# EAGLE design PET_Diag_Clip (EAGLE 9.6.2)
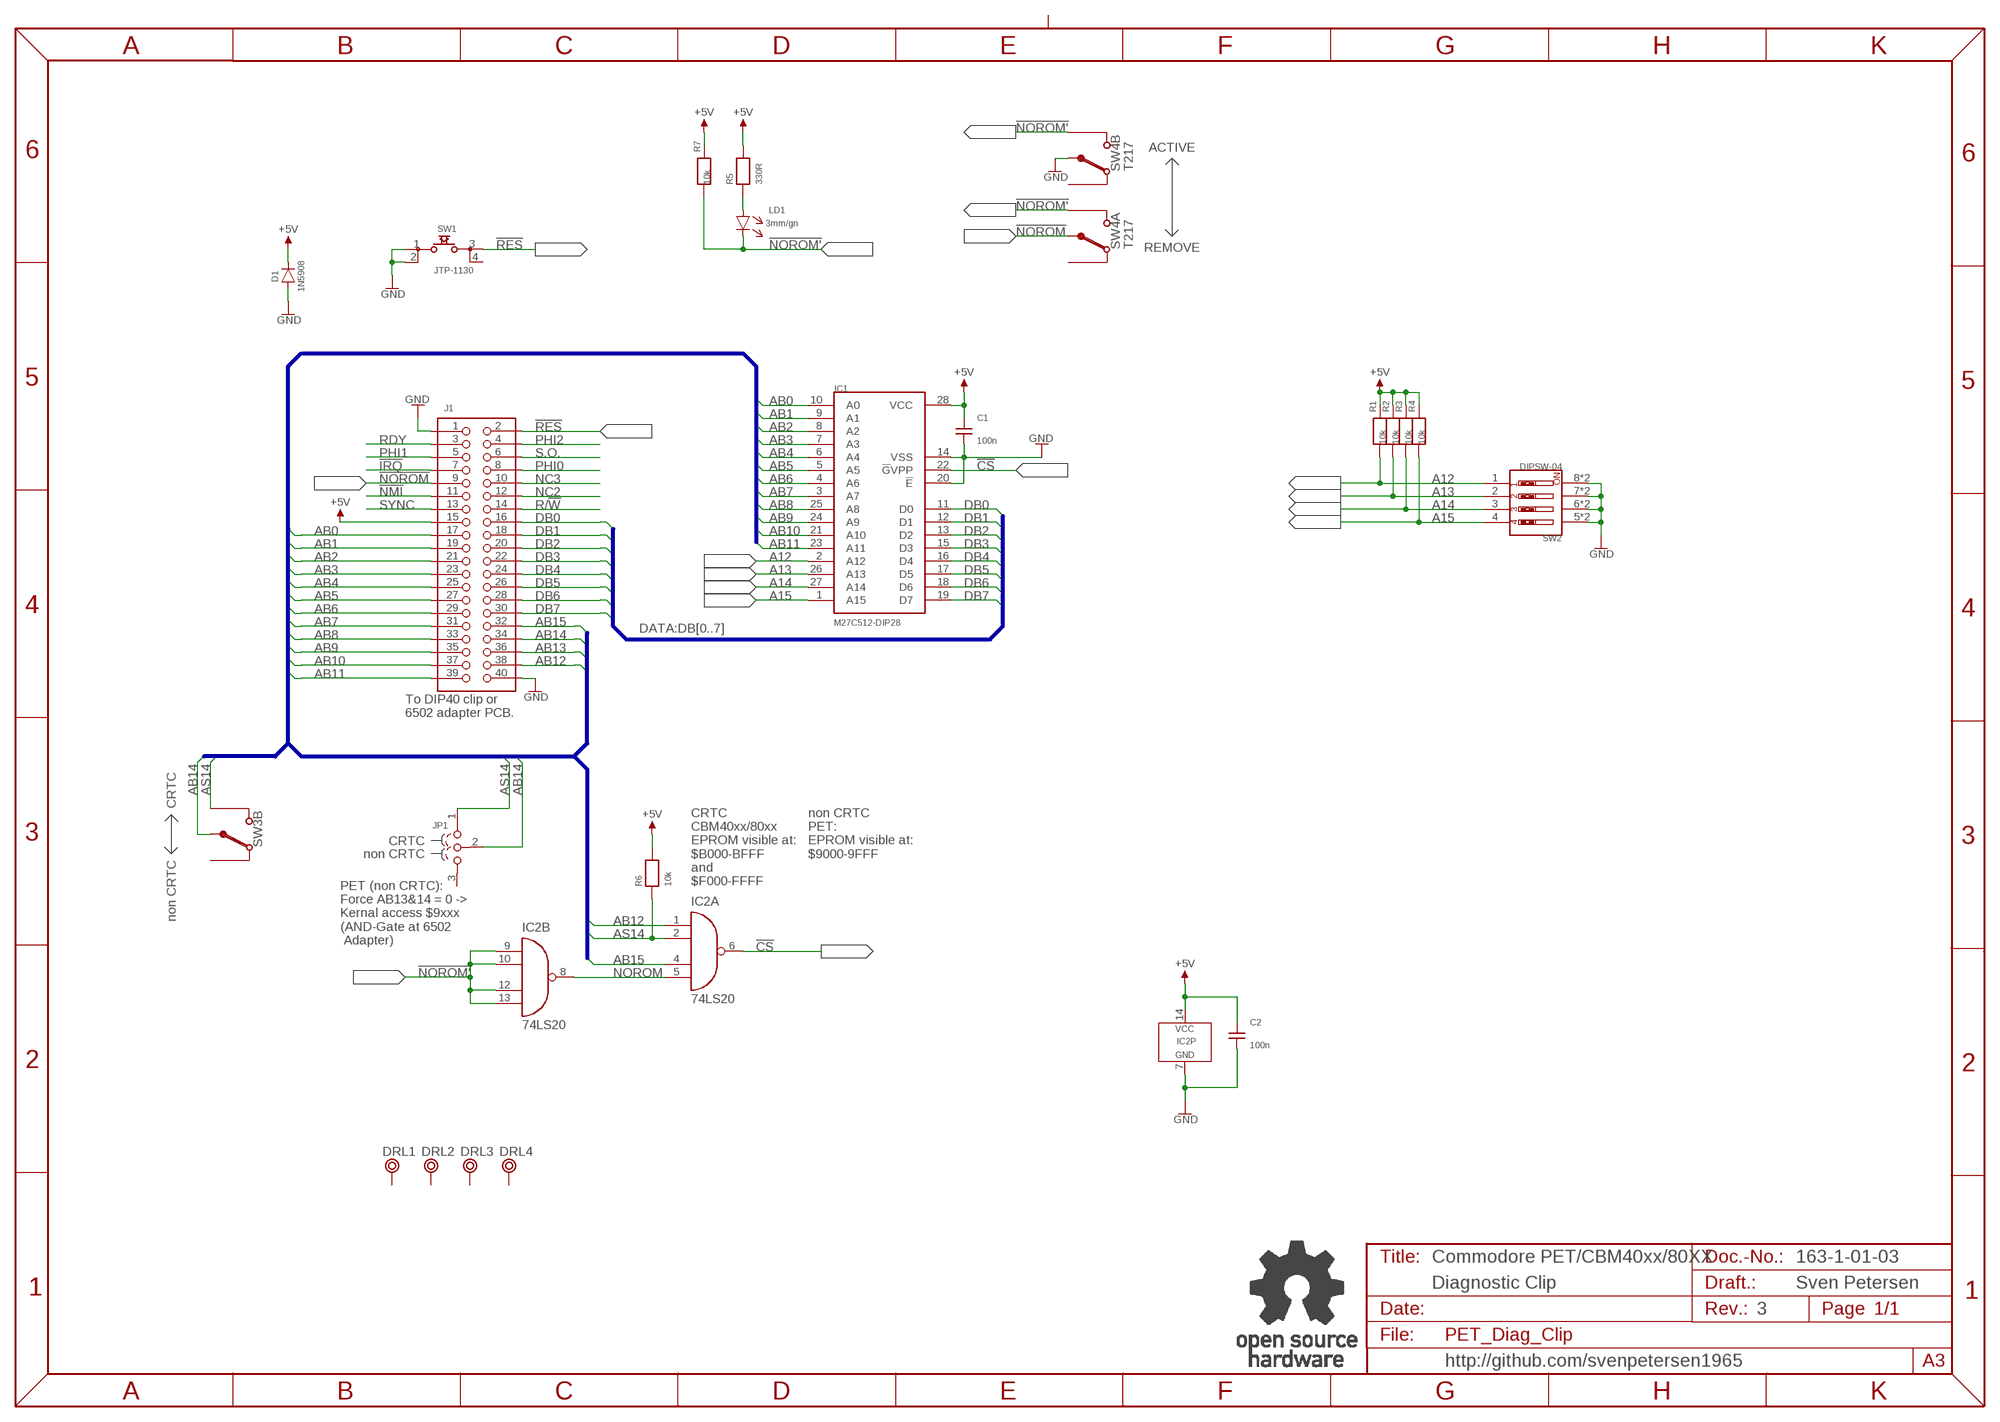
[diagram p0: schematic, sheet 1]

## Parts
C1  100n  CAP01  [C-2,5]
C2  100n  CAP01  [C-2,5]
D1  1N5908  1N5402  [DO-201]
DRL1  BOHR3,5  [BOHR3,5]
DRL2  BOHR3,5  [BOHR3,5]
DRL3  BOHR3,5  [BOHR3,5]
DRL4  BOHR3,5  [BOHR3,5]
IC1  M27C512-DIP28  [DIL28-6]
IC2  74LS20  7420N  [DIL-14]
J1  PINHD-2X20WV  [2X20WV]
JP1  COMBI-3P  [COMBI-3P]
LD1  3mm/gn  3MM  [3MM]
R1  10k  RES04  [R-10]
R2  10k  RES04  [R-10]
R3  10k  RES04  [R-10]
R4  10k  RES04  [R-10]
R5  330R  RES04  [R-10]
R6  10k  RES04  [R-10]
R7  10k  RES04  [R-10]
SW1  JTP-1130  [JTP-1130]
SW2  DIPSW-04  [DIPSW-04V-COMBI]
SW3  MSS22D18  DPDT_9MM  [DPDT_9MM]
SW4  T217  [T217_SIDE]
U$13  OPEN_SOURCE_HW  [OPENHW]

## Nets
!CS: IC1.22(!G!VPP) IC2.6(A:O)
!IRQ: J1.7
!NMI: J1.11
!NOROM: J1.9 SW4.COM1(A:COM)
!NOROM': IC2.9(B:I0) IC2.10(B:I1) IC2.12(B:I2) IC2.13(B:I3) LD1.C(K) R7.2 SW4.UP1(A:UP) SW4.UP2(B:UP)
!RES: J1.2 SW1.3
+5V: C1.2 C2.2 D1.K IC1.28(VCC) IC2.14(P:VCC) J1.15 R1.1 R2.1 R3.1 R4.1 R5.2 R6.2 R7.1
A12: IC1.2(A12) R1.2 SW2.1
A13: IC1.26(A13) R2.2 SW2.2
A14: IC1.27(A14) R3.2 SW2.3
A15: IC1.1(A15) R4.2 SW2.4
AB0: IC1.10(A0) J1.17
AB1: IC1.9(A1) J1.19
AB2: IC1.8(A2) J1.21
AB3: IC1.7(A3) J1.23
AB4: IC1.6(A4) J1.25
AB5: IC1.5(A5) J1.27
AB6: IC1.4(A6) J1.29
AB7: IC1.3(A7) J1.31
AB8: IC1.25(A8) J1.33
AB9: IC1.24(A9) J1.35
AB10: IC1.21(A10) J1.37
AB11: IC1.23(A11) J1.39
AB12: IC2.1(A:I0) J1.38
AB13: J1.36
AB14: J1.34 JP1.2 SW3.5(B:COM)
AB15: IC2.4(A:I2) J1.32
AS14: IC2.2(A:I1) JP1.1 R6.1 SW3.6(B:UP)
DB0: IC1.11(D0) J1.16
DB1: IC1.12(D1) J1.18
DB2: IC1.13(D2) J1.20
DB3: IC1.15(D3) J1.22
DB4: IC1.16(D4) J1.24
DB5: IC1.17(D5) J1.26
DB6: IC1.18(D6) J1.28
DB7: IC1.19(D7) J1.30
GND: C1.1 C2.1 D1.A IC1.14(VSS) IC1.20(!E) IC2.7(P:GND) J1.1 J1.40 SW1.1 SW1.2 SW2.5 SW2.5A SW2.6 SW2.6A SW2.7 SW2.7A SW2.8 SW2.8A SW4.COM2(B:COM)
N$1: LD1.A R5.1
NC2: J1.12
NC3: J1.10
NOROM: IC2.5(A:I3) IC2.8(B:O)
PHI0: J1.8
PHI1: J1.5
PHI2: J1.4
R/!W: J1.14
RDY: J1.3
S.O.: J1.6
SYNC: J1.13
Unconnected: DRL1.P$1 DRL2.P$1 DRL3.P$1 DRL4.P$1 JP1.3 SW1.4 SW3.1(A:UP) SW3.2(A:COM) SW3.3(A:DWN) SW3.4(B:DWN) SW4.DWN1(A:DWN) SW4.DWN2(B:DWN)

## Buses
DATA:DB[0..7]
ADR:AB[0..15],AS14

## Notes on the sheet
- ACTIVE
- REMOVE
- To DIP40 clip or
  6502 adapter PCB.
- CRTC
- CRTC
  CBM40xx/80xx
  EPROM visible at:
  $B000-BFFF
  and
  $F000-FFFF
- non CRTC
  PET:
  EPROM visible at:
  $9000-9FFF
- CRTC
- non CRTC
- non CRTC
- PET (non CRTC):
  Force AB13&14 = 0 ->
  Kernal access $9xxx
  (AND-Gate at 6502
   Adapter)
- Commodore PET/CBM40xx/80XX | 163-1-01-03
- Diagnostic Clip | Sven Petersen
- 3
- http://github.com/svenpetersen1965

## Library data of the parts
C1 C2 = DISCRETE:CAP01
D1 = Dioden:1N5402
DRL1-DRL4 = Mech_Bohr:BOHR3,5
IC1 = ST:M27C512
IC2 = 74XX:7420
J1 = PINHEAD:PINHD-2X20
JP1 = Cutpad:COMBI-3P
LD1 = LED:3MM
R1-R7 = DISCRETE:RES04
SW1 = Namae_Electronics:JTP-1130
SW2 = DIPSWITCH:DIPSW-04
SW3 = switches:DPDT_9MM
SW4 = wentronic:T217
U$13 = Logo:OPEN_SOURCE_HW

## Board
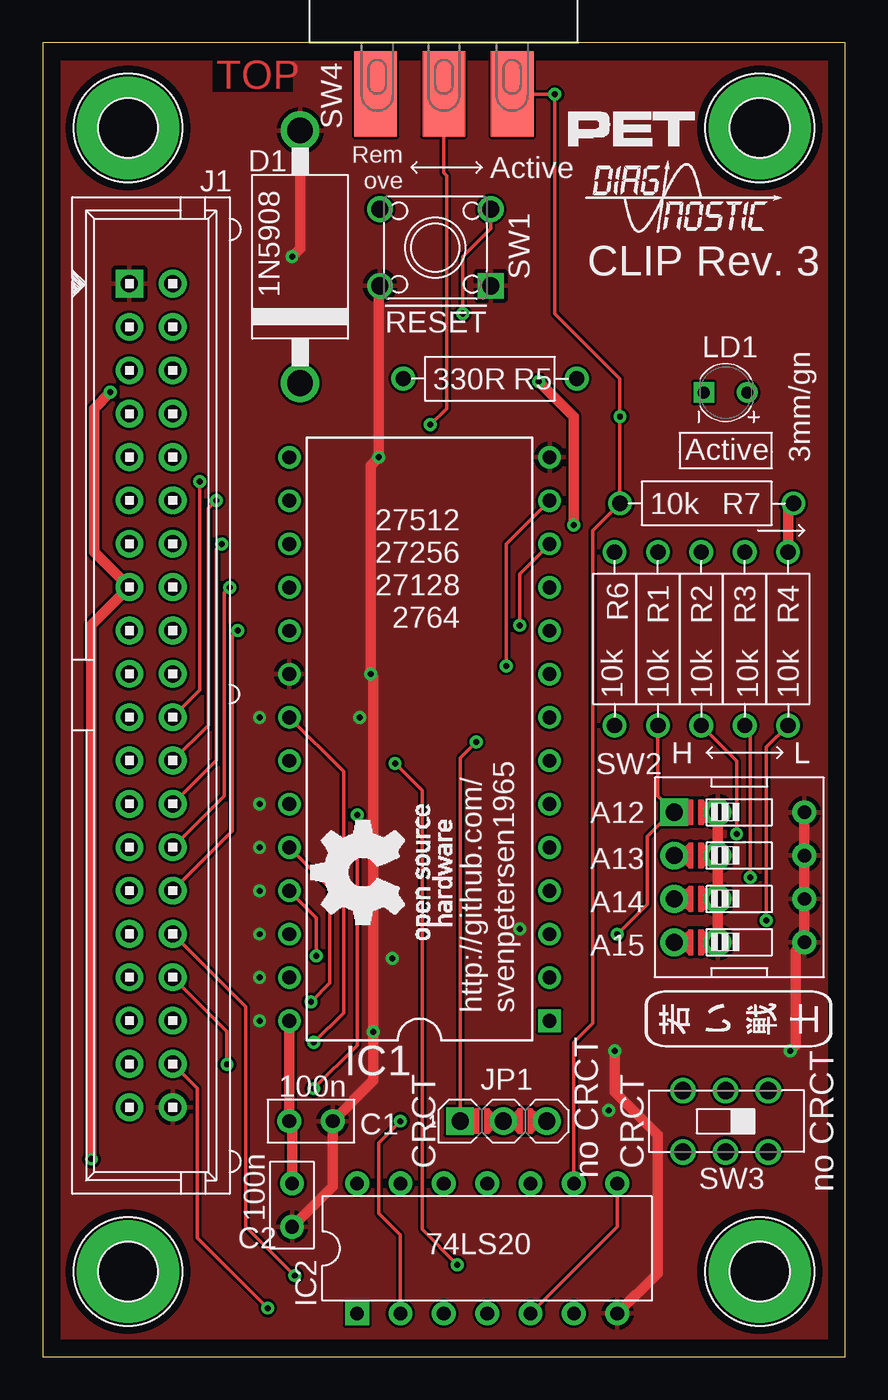
[diagram p1: board, top side]
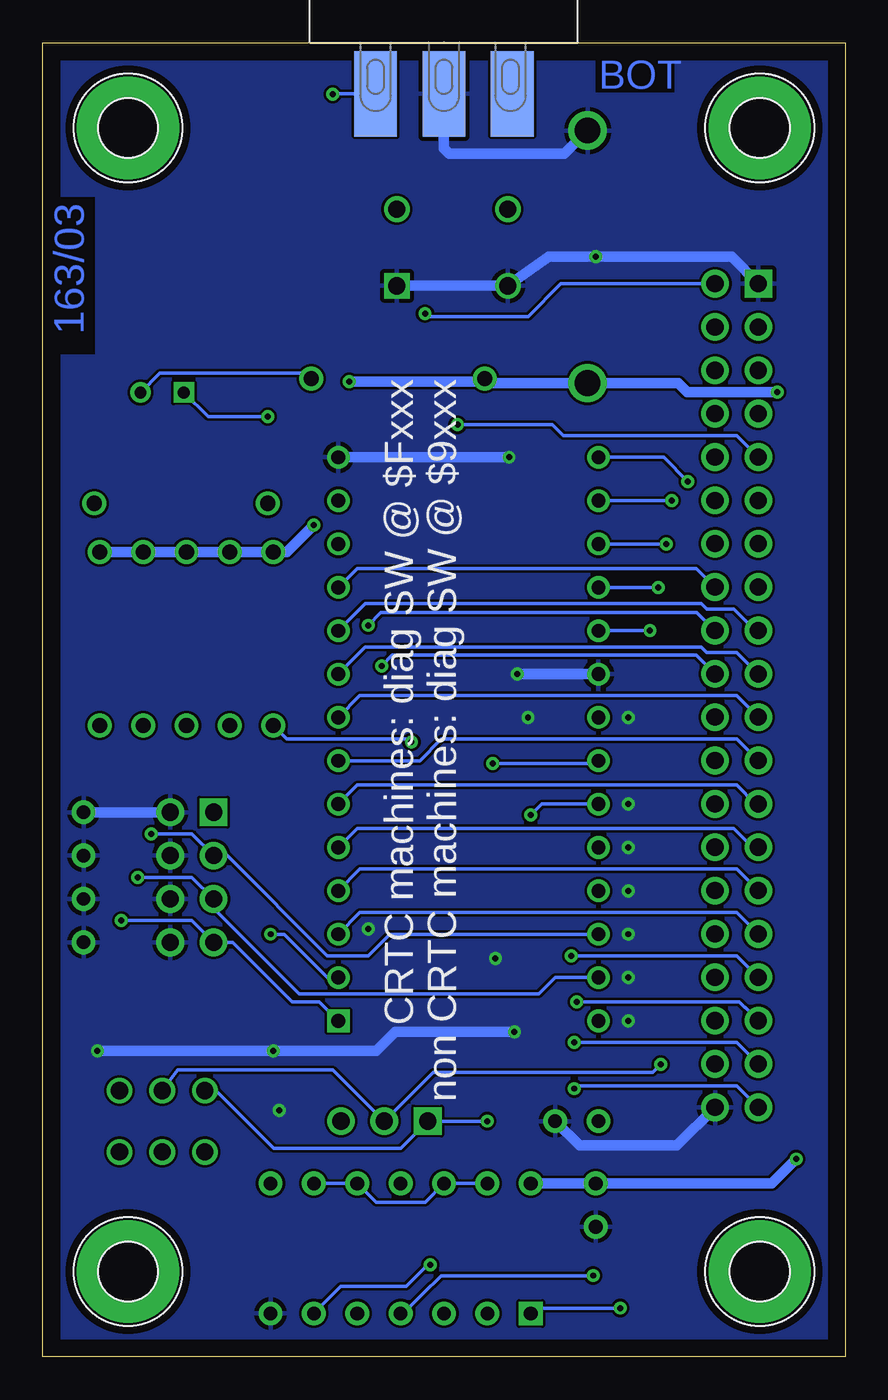
[diagram p2: board, bottom side, seen from below]

Size 47 x 77 mm. Coordinates in mm from the lower left corner, seen from the top.
Outline: 0,0 47,0 47,77 0,77 0,0
Copper layers (1*16): Top 0.035mm / dielectric 1.5mm / Bottom 0.035mm
Design rules "default *": minimum track width 6mil, minimum drill 0.35mm, track to track 6mil, track to pad 6mil, pad to pad 6mil, via to via 6mil, smd to smd 6mil, copper to edge 40mil, drill to drill 6mil, minimum pad ring 10mil, minimum via ring 8mil, stop-mask expansion 4mil, vias tented up to drill 25mil, thermal gap 10mil
bRestrict: 3 lines

### Footprints (pad centres in the part's own frame; a part is rotated, then mirrored left to right if it is on the bottom)
C-2,5 = drill 0.8 pad 1.397: 1 -1.27,0; 2 1.27,0
DO-201 = drill 1.5: A -7.4,0; K 7.4,0
BOHR3,5 = drill 3.5 pad 6: P$1 0,0
DIL28-6 = drill 0.813 square: 1 -16.51,-7.62 | drill 0.813: 2 -13.97,-7.62; 3 -11.43,-7.62; 4 -8.89,-7.62; 5 -6.35,-7.62; 6 -3.81,-7.62; 7 -1.27,-7.62; 8 1.27,-7.62; 9 3.81,-7.62; 10 6.35,-7.62; 11 8.89,-7.62; 12 11.43,-7.62; 13 13.97,-7.62; 14 16.51,-7.62; 15 16.51,7.62; 16 13.97,7.62; 17 11.43,7.62; 18 8.89,7.62; 19 6.35,7.62; 20 3.81,7.62; 21 1.27,7.62; 22 -1.27,7.62; 23 -3.81,7.62; 24 -6.35,7.62; 25 -8.89,7.62; 26 -11.43,7.62; 27 -13.97,7.62; 28 -16.51,7.62
DIL-14 = drill 0.8 pad 1.397 square: 1 -7.62,-3.81 | drill 0.8 pad 1.397: 2 -5.08,-3.81; 3 -2.54,-3.81; 4 0,-3.81; 5 2.54,-3.81; 6 5.08,-3.81; 7 7.62,-3.81; 8 7.62,3.81; 9 5.08,3.81; 10 2.54,3.81; 11 0,3.81; 12 -2.54,3.81; 13 -5.08,3.81; 14 -7.62,3.81
2X20WV = drill 1 pad 1.626 square: 1 -24.13,-1.27 | drill 1 pad 1.626: 2 -24.13,1.27; 3 -21.59,-1.27; 4 -21.59,1.27; 5 -19.05,-1.27; 6 -19.05,1.27; 7 -16.51,-1.27; 8 -16.51,1.27; 9 -13.97,-1.27; 10 -13.97,1.27; 11 -11.43,-1.27; 12 -11.43,1.27; 13 -8.89,-1.27; 14 -8.89,1.27; 15 -6.35,-1.27; 16 -6.35,1.27; 17 -3.81,-1.27; 18 -3.81,1.27; 19 -1.27,-1.27; 20 -1.27,1.27; 21 1.27,-1.27; 22 1.27,1.27; 23 3.81,-1.27; 24 3.81,1.27; 25 6.35,-1.27; 26 6.35,1.27; 27 8.89,-1.27; 28 8.89,1.27; 29 11.43,-1.27; 30 11.43,1.27; 31 13.97,-1.27; 32 13.97,1.27; 33 16.51,-1.27; 34 16.51,1.27; 35 19.05,-1.27; 36 19.05,1.27; 37 21.59,-1.27; 38 21.59,1.27; 39 24.13,-1.27; 40 24.13,1.27
COMBI-3P = drill 1 pad 1.626 square: 1 -2.54,0 | drill 1 pad 1.626: 2 0,0; 3 2.54,0
3MM = drill 0.7: A -1.27,0 | drill 0.7 square: C 1.27,0
R-10 = drill 0.889 pad 1.397: 1 -5.08,0; 2 5.08,0
JTP-1130 = drill 1 square: 1 3.25,-2.25 | drill 1: 2 -3.25,-2.25; 3 3.25,2.25; 4 -3.25,2.25
DIPSW-04V-COMBI = drill 1 pad 1.626 square: 1 -3.81,-3.81 | drill 1 pad 1.626: 2 -1.27,-3.81; 3 1.27,-3.81; 4 3.81,-3.81; 5A 3.81,-1.27; 6A 1.27,-1.27; 7A -1.27,-1.27; 8A -3.81,-1.27 | drill 0.787 pad 1.397: 5 3.81,3.81; 6 1.27,3.81; 7 -1.27,3.81; 8 -3.81,3.81
DPDT_9MM = drill 1: 1 -1.8,2.5; 2 -1.8,0; 3 -1.8,-2.5; 4 1.8,-2.5; 5 1.8,0; 6 1.8,2.5
T217_SIDE = smd 5 x 2.5: COM1 3,0; DWN1 3,-4; UP1 3,4 | smd 5 x 2.5 bottom: COM2 3,0; DWN2 3,-4; UP2 3,4

### Placement (x,y rotation side)
C1  15.72,13.81 180 top
C2  14.61,8.89 90 top
D1  15.08,64.45 270 top
DRL1  5,5 0 top
DRL2  42,5 0 top
DRL3  42,72 0 top
DRL4  5,72 0 top
IC1  22.07,36.2 90 top
IC2  26.04,6.35 0 top
J1  6.35,38.75 270 top
JP1  26.99,13.81 0 top
LD1  40,56.5 180 top
R1  36.04,42.07 270 top
R2  38.58,42.07 270 top
R3  41.12,42.07 270 top
R4  43.66,42.07 270 top
R5  26.19,57.31 180 top
R6  33.5,42.07 90 top
R7  38.89,50.01 180 top
SW1  23,65 0 top
SW2  40.8,28.1 270 top
SW3  40,13.8 90 top
SW4  23.5,77 270 top
U$13  23.97,24.45 90 top
U$27  [PET_SMALL]  30.8,70.96 0 top
U$30  [DIAG_SMALL]  31.75,65.88 0 top
U$34  [2LAYER]  10.16,74.3 0 top
U$35  [PCB-TITLE/]  0.48,93.34 0 top  (outside the outline)
U$42  [SVEN_TAG]  40.64,19.84 90 top

### Tracks (layer width: path | path; a pad name or v marks a point on that pad's centre or on a via)
!CS  (via drill 0.35)
  Top 0.203: v24.29,5.4 22.23,7.46 22.23,33.18 v20.64,34.77
  Bottom 0.203: v24.29,5.4 24.45,5.4 25.72,4.13 29.53,4.13 IC2.6 | v20.64,34.77 14.61,34.77 IC1.22
!NOROM  (via drill 0.35)
  Top 0.203: v22.7,54.61 23.65,55.56 23.65,69.22 23.5,69.37 SW4.COM1
  Bottom 0.203: J1.9 6.33,53.98 16.51,53.98 17.14,54.61 v22.7,54.61
!NOROM'  (via drill 0.35)
  Top 0.203: IC2.9 31.11,18.41 32.23,19.53 32.23,48.42 R7.2 v33.81,55.09 33.81,57.31 30,61.12 v30,73.98 27.52,73.98 SW4.UP1
  Bottom 0.203: v33.81,55.09 37.32,55.09 LD1.C | IC2.13 IC2.12 24.61,9.05 27.46,9.05 IC2.10 IC2.9 | SW4.UP1 29.98,74 v30,73.98
!RES  (via drill 0.35)
  Top 0.203: v24.61,61.12 24.61,64.45 26.25,66.1 SW1.3
  Bottom 0.203: J1.2 16.65,62.88 18.57,60.96 24.45,60.96 v24.61,61.12
+5V  (via drill 0.35)
  Top 0.61: IC1.28 C1.2 14.61,13.65 C2.2 | v2.86,11.59 2.86,42.88 J1.15 3.02,47.16 3.02,55.56 v3.97,56.52 | v31.11,48.74 31.11,55.09 v29.05,57.15 | R4.1 43.66,49.69 R7.1
  Bottom 0.61: IC2.14 C2.2 4.29,10.16 v2.86,11.59 | v3.97,56.52 4.54,56.52 | 4.54,56.52 4.55,56.53 | R4.1 R3.1 R2.1 R1.1 R6.2 32.7,47.15 v31.11,48.74 | 4.54,56.52 4.55,56.53 | 4.55,56.53 9.26,56.53 9.78,57.05 D1.K 20.86,57.05 R5.2 21.27,57.15 v29.05,57.15
A12  (via drill 0.35)
  Top 0.203: v33.66,24.77 35.4,26.51 35.4,30.48 36.83,31.91 SW2.1 36.04,32.86 R1.2
  Bottom 0.203: IC1.2 30.32,22.23 32.86,24.77 v33.66,24.77
A13  (via drill 0.35)
  Top 0.203: v40.64,30.64 40.64,34.92 R2.2
  Bottom 0.203: IC1.26 26.67,24.77 27.94,23.5 30.32,23.5 36.2,29.37 SW2.2 38.26,30.64 v40.64,30.64
A14  (via drill 0.35)
  Top 0.203: v41.43,28.1 41.43,36.67 R3.2
  Bottom 0.203: IC1.27 16.99,22.23 17.94,21.27 31.98,21.27 36.99,26.28 SW2.3 38.26,28.1 v41.43,28.1
A15  (via drill 0.35)
  Top 0.203: v42.39,25.56 42.39,35.72 R4.2
  Bottom 0.203: IC1.1 30.8,20.8 32.38,20.8 35.88,24.29 SW2.4 38.26,25.56 v42.39,25.56
AB0
  Bottom 0.203: J1.17 5.25,42.56 6.51,43.81 8.1,43.81 8.26,43.97 8.41,44.13 28.1,44.13 28.42,43.81 IC1.10
AB1
  Bottom 0.203: J1.19 6.33,41.27 8.1,41.27 8.41,41.59 15.56,41.59 28.1,41.59 28.42,41.27 IC1.9
AB2
  Bottom 0.203: J1.21 6.33,38.73 28.42,38.73 IC1.8
AB3
  Bottom 0.203: J1.23 6.33,36.2 23.65,36.2 24.92,34.92 IC1.7
AB4
  Bottom 0.203: J1.25 5.25,32.4 6.35,33.5 28.57,33.5 IC1.6
AB5
  Bottom 0.203: J1.27 5.41,29.86 6.51,30.96 28.57,30.96 IC1.5
AB6
  Bottom 0.203: J1.29 6.33,28.57 28.42,28.57 IC1.4
AB7
  Bottom 0.203: J1.31 6.33,26.04 28.42,26.04 IC1.3
AB8  (via drill 0.35)
  Top 0.203: v16.03,23.5 16.03,25.72 IC1.25
  Bottom 0.203: J1.33 6.33,23.5 v16.03,23.5
AB9  (via drill 0.35)
  Top 0.203: v15.72,20.8 16.83,21.91 16.83,27.46 IC1.24
  Bottom 0.203: J1.35 5.86,20.48 5.87,20.48 6.19,20.8 15.08,20.8 v15.72,20.8
AB10  (via drill 0.35)
  Top 0.203: v15.88,18.41 17.62,20.16 17.62,34.29 IC1.21
  Bottom 0.203: J1.37 6.33,18.41 v15.88,18.41
AB11  (via drill 0.35)
  Top 0.203: v15.88,15.72 18.41,18.26 v18.41,31.75
  Bottom 0.203: J1.39 6.33,15.88 15.88,15.88 v15.88,15.72 | v18.41,31.75 17.78,32.38 IC1.23
AB12  (via drill 0.35)
  Top 0.203: J1.38 9.05,15.73 9.05,6.99 v13.18,2.86
  Bottom 0.203: v13.18,2.86 18.1,2.86 IC2.1
AB14  (via drill 0.35)
  Top 0.203: J1.34 10.79,19.07 v10.79,17.14
  Bottom 0.203: v10.79,17.14 11.27,16.67 24.13,16.67 JP1.2 30,16.83 39.08,16.83 SW3.5
AB15  (via drill 0.35)
  Top 0.203: J1.32 11.91,20.49 11.91,7.62 v14.76,4.76
  Bottom 0.203: v14.76,4.76 23.65,4.76 24.77,3.65 25.88,2.54 IC2.4
AS14  (via drill 0.35)
  Top 0.203: IC2.2 20.95,7.14 19.68,8.41 19.68,12.54 v20.95,13.81 | v25.4,36.04 24.45,35.08 JP1.1
  Bottom 0.203: v25.4,36.04 25.56,36.2 32.7,36.2 R6.1 | SW3.6 36.86,15.61 33.47,12.22 26.04,12.22 JP1.1 v20.95,13.81
DB0
  Bottom 0.203: J1.16 7.63,45.1 8.73,46.2 28.57,46.2 IC1.11
DB1  (via drill 0.35)
  Top 0.203: v27.94,42.86 27.94,45.88 IC1.12
  Bottom 0.203: J1.18 8.68,43.62 27.18,43.62 v27.94,42.86
DB2  (via drill 0.35)
  Top 0.203: v27.15,40.48 27.15,47.62 IC1.13
  Bottom 0.203: J1.20 8.72,41.12 26.51,41.12 v27.15,40.48
DB3  (via drill 0.35)
  Top 0.203: J1.22 9.21,39.07 v9.21,51.28
  Bottom 0.203: v9.21,51.28 10.64,52.7 IC1.15
DB4  (via drill 0.35)
  Top 0.203: J1.24 9.68,37 9.68,49.69 v10.16,50.16
  Bottom 0.203: v10.16,50.16 IC1.16
DB5  (via drill 0.35)
  Top 0.203: J1.26 10.16,34.94 10.16,47.31 v10.48,47.62
  Bottom 0.203: v10.48,47.62 IC1.17
DB6  (via drill 0.35)
  Top 0.203: J1.28 10.64,32.88 10.64,44.77 v10.95,45.09
  Bottom 0.203: v10.95,45.09 IC1.18
DB7  (via drill 0.35)
  Top 0.203: J1.30 11.11,30.81 11.11,42.23 v11.43,42.55
  Bottom 0.203: v11.43,42.55 IC1.19
GND  (via drill 0.35)
  Top 0.61: C2.1 16.99,10 16.99,11.59 C1.1 19.37,16.19 v19.37,19.05 19.37,39.85 v19.21,40.01 19.21,52.23 v19.68,52.7 19.68,62.13 SW1.2 | IC2.7 36.01,4.9 36.01,13.02 33.5,15.53 v33.5,17.94 | D1.A 15.08,64.93 v14.61,64.45 | SW2.5A SW2.6A SW2.7A SW2.8A | SW2.8 SW2.7 SW2.6 SW2.5 44.11,23.79 44.11,18.26 v43.79,17.94
  Bottom 0.61: J1.40 9.86,12.38 15.56,12.38 C1.1 | v19.21,40.01 IC1.20 | v19.68,52.7 IC1.14 | J1.1 6.65,64.45 v14.61,64.45 17.36,64.45 SW1.2 SW1.1 | v19.37,19.05 26.35,19.05 27.46,17.94 v33.5,17.94 v43.79,17.94 | SW2.8A SW2.8 | SW4.COM2 23.5,70.8 23.18,70.48 16.45,70.48 D1.A
  other vias: 12.7,19.68 12.7,22.23 12.7,24.77 12.7,27.3 12.7,29.84 12.7,32.38 12.7,37.47 20.48,23.34 27.94,25.08 18.57,37.47 33.16,14.45
  pour Top: 1.11,75.88 46.04,75.88 46.04,0.95 1.11,0.95
  pour Bottom: 1.11,75.88 46.04,75.88 46.04,0.95 1.11,0.95
N$1
  Bottom 0.203: R5.1 31.59,57.63 40.14,57.63 LD1.A
NOROM
  Top 0.203: IC2.5 33.66,7.62 IC2.8

### Text on the board
Bottom: 163/03
tPlace: Active | CLIP | Rev. 3 | !RESET | Active | 27512 / 27256 / 27128 / 2764 | H | L | A12 | A13 | A14 | A15 | http://github.com/ / svenpetersen1965 | no CRCT | CRCT | CRCT | no CRCT
bPlace: CRTC machines: diag SW @ $Fxxx / non CRTC machines: diag SW @ $9xxx
tNames: Rem / ove
Measures: 4-3.5mm
Document: 163-2-01-03 | Sven Petersen / 2024 | 35µm | 2 | 3